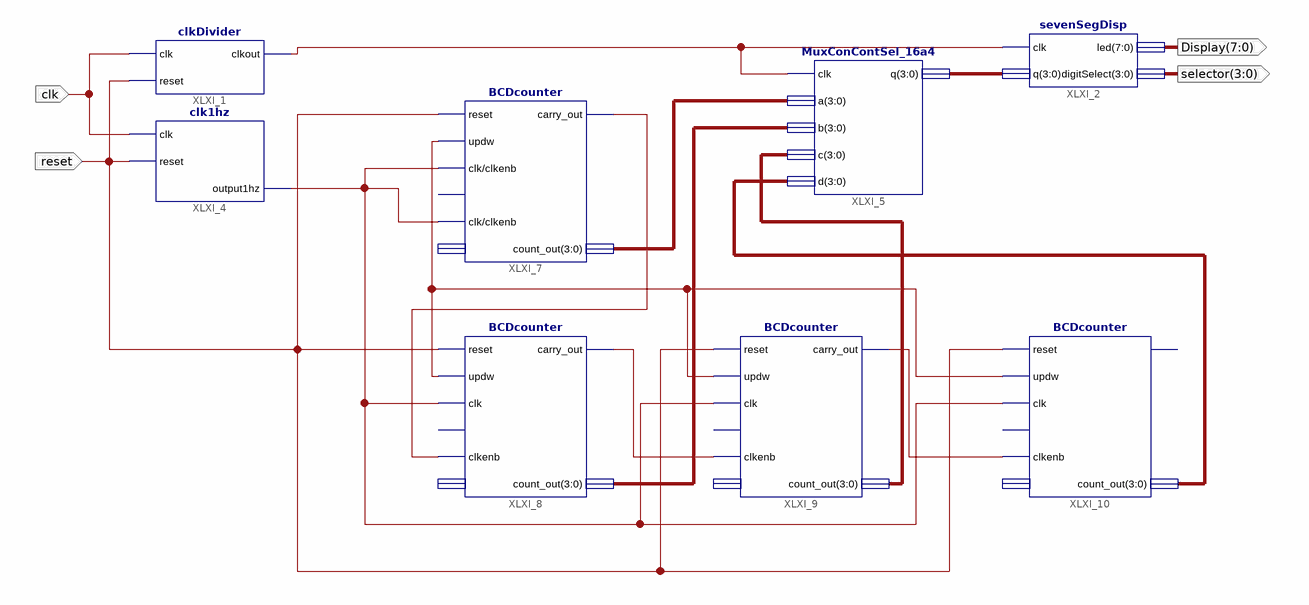
[diagram p0: schematic sheet 1]
// Xilinx ISE schematic top.sch (spartan3e) as structural Verilog: 8 symbols, 4 ports
module top (
  input  clk,
  input  reset,
  output [7:0] Display,
  output [3:0] selector
);

  wire updw, XLXN_28, XLXN_29, XLXN_31, XLXN_32, XLXN_33;
  wire [3:0] XLXN_27, XLXN_37, XLXN_38, XLXN_39, XLXN_40;

  clkDivider XLXI_1 (.clk(clk), .reset(reset), .clkout(XLXN_28));
  clk1hz XLXI_4 (.clk(clk), .reset(reset), .output1hz(XLXN_29));
  MuxConContSel_16a4 XLXI_5 (.clk(XLXN_28), .a(XLXN_37), .b(XLXN_38), .c(XLXN_39), .d(XLXN_40), .q(XLXN_27));
  sevenSegDisp XLXI_2 (.clk(XLXN_28), .q(XLXN_27), .led(Display), .digitSelect(selector));
  BCDcounter XLXI_7 (
    .reset(reset), .updw(updw), .clk(XLXN_29), .clkenb(XLXN_29), .carry_out(XLXN_31), .count_out(XLXN_37));  // open: loadenb, load_in
  BCDcounter XLXI_8 (
    .reset(reset), .updw(updw), .clk(XLXN_29), .clkenb(XLXN_31), .carry_out(XLXN_32), .count_out(XLXN_38));  // open: loadenb, load_in
  BCDcounter XLXI_9 (
    .reset(reset), .updw(updw), .clk(XLXN_29), .clkenb(XLXN_32), .carry_out(XLXN_33), .count_out(XLXN_39));  // open: loadenb, load_in
  BCDcounter XLXI_10 (
    .reset(reset), .updw(updw), .clk(XLXN_29), .clkenb(XLXN_33), .count_out(XLXN_40));  // open: loadenb, load_in, carry_out
endmodule
